# EAGLE schematic nodemcu breakout (EAGLE 9.6.2)
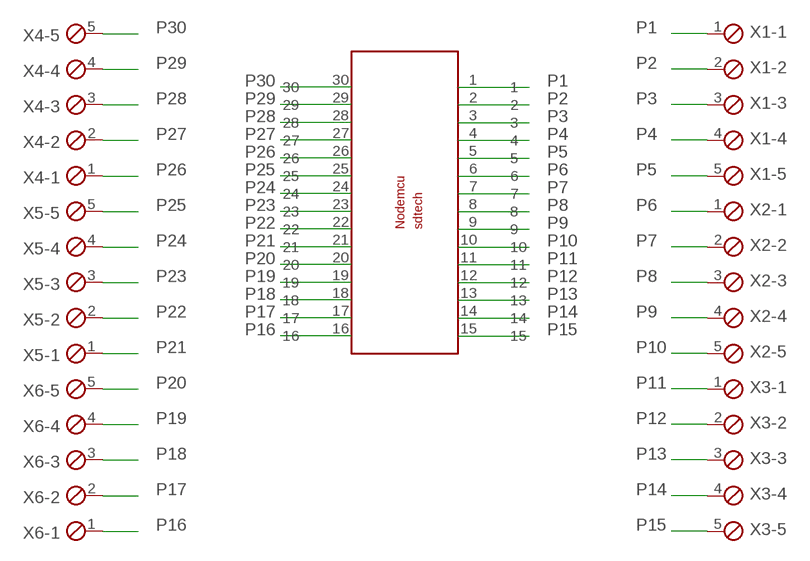
[diagram p0: schematic, sheet 1]

## Parts
U$1  NODEMCUESP8266  [NODEMCUESP8266]
X1  MPT5  [5POL254]
X2  MPT5  [5POL254]
X3  MPT5  [5POL254]
X4  MPT5  [5POL254]
X5  MPT5  [5POL254]
X6  MPT5  [5POL254]

## Nets
P1: U$1.1 X1.1
P2: U$1.2 X1.2
P3: U$1.3 X1.3
P4: U$1.4 X1.4
P5: U$1.5 X1.5
P6: U$1.6 X2.1
P7: U$1.7 X2.2
P8: U$1.8 X2.3
P9: U$1.9 X2.4
P10: U$1.10 X2.5
P11: U$1.11 X3.1
P12: U$1.12 X3.2
P13: U$1.13 X3.3
P14: U$1.14 X3.4
P15: U$1.15 X3.5
P16: U$1.16 X6.1
P17: U$1.17 X6.2
P18: U$1.18 X6.3
P19: U$1.19 X6.4
P20: U$1.20 X6.5
P21: U$1.21 X5.1
P22: U$1.22 X5.2
P23: U$1.23 X5.3
P24: U$1.24 X5.4
P25: U$1.25 X5.5
P26: U$1.26 X4.1
P27: U$1.27 X4.2
P28: U$1.28 X4.3
P29: U$1.29 X4.4
P30: U$1.30 X4.5

## Library data of the parts
U$1 = NODEMCU:NODEMCUESP8266: Node Mcu esp8266 12E LIBRARY BY SDTECH ROBOTICS (Shubham Devkar Technology Solutions)
X1-X6 = con-phoenix-254:MPT5: PHOENIX CONNECTOR; OC_FARNELL: unknown; OC_NEWARK: unknown